# EAGLE design TSOC_GROVEY_WIFI_R0_2 (EAGLE 6.6.0)
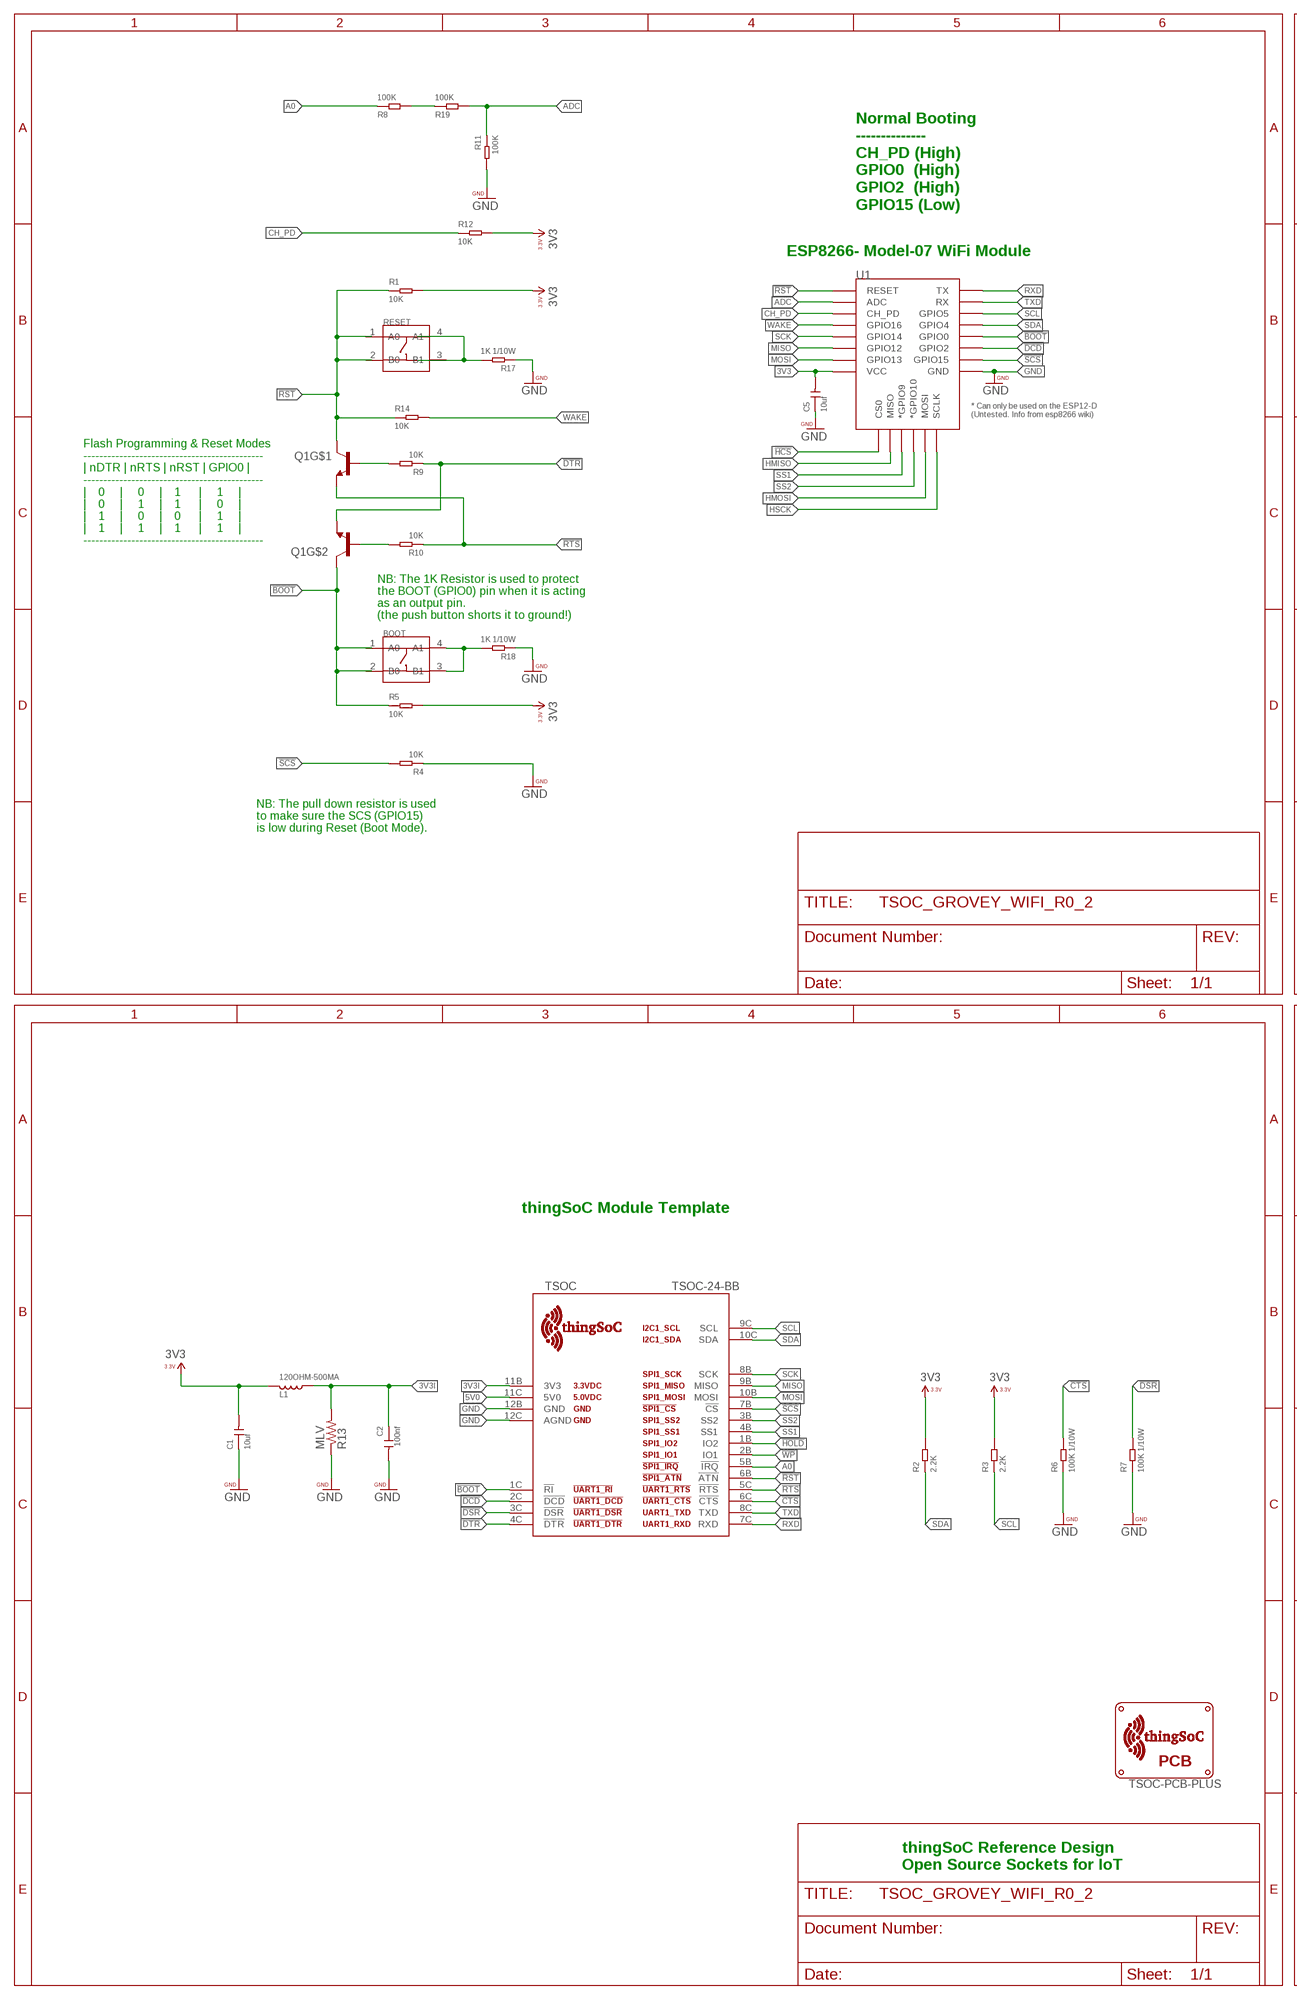
[diagram p0: schematic, sheet 1, part 1 of 2]
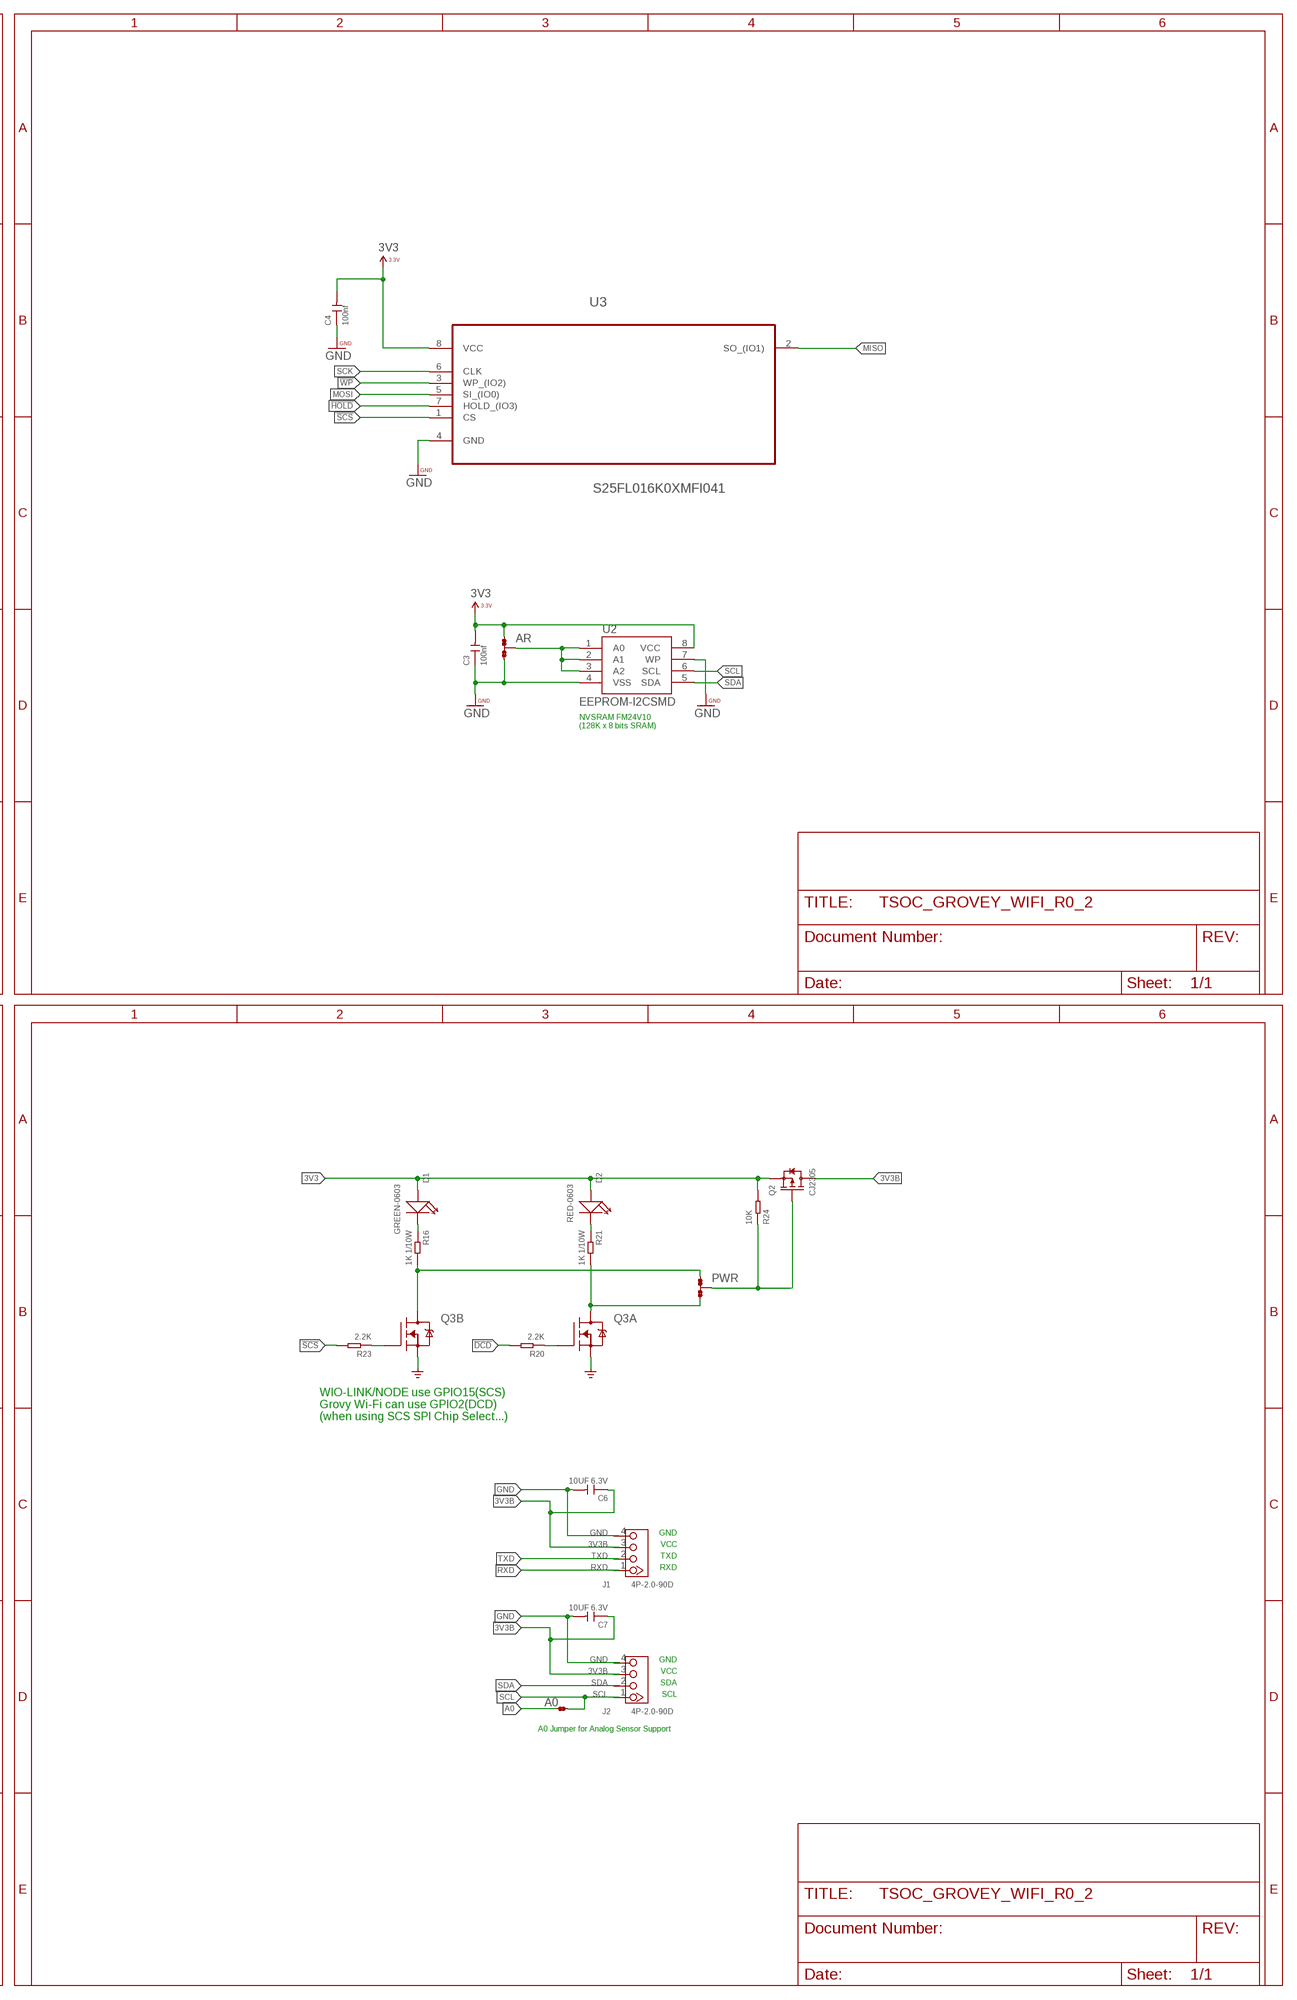
[diagram p1: schematic, sheet 1, part 2 of 2]

## Parts
A0  JMP-2-NO  [JMP-2-NO]
AR  JMP-3-1_2  [JMP-3-1_2]
BOOT  SMD-SWITCH-TACTILE-SPST-NO(4P-D6.0MM)  [SW4-SMD-6.0X6.0X5.0MM]
C1  10uf  CERAMIC-10UF-25V-10%-X5R(1206)  [C1206]
C2  100nf  CERAMIC-100NF-50V-10%-X7R(0603)  [C0603]
C3  100nf  CERAMIC-100NF-50V-10%-X7R(0603)  [C0603]
C4  100nf  CERAMIC-100NF-50V-10%-X7R(0603)  [C0603]
C5  10uf  CERAMIC-10UF-25V-10%-X5R(1206)  [C1206]
C6  10UF 6.3V  CERAMIC-10UF-6.3V-20%-X5R(0603)  [C0603]
C7  10UF 6.3V  CERAMIC-10UF-6.3V-20%-X5R(0603)  [C0603]
D1  GREEN-0603  SMD-LED-CLEAR-GREEN(0603)  [LED-0603]
D2  RED-0603  LED-SMD-RED-DIFFUSED(0603)  [LED-0603]
J1  4P-2.0-90D  GROVE-CONNECTOR-DIP-90D(4P-2.0)  [HW4-2.0-90D]
J2  4P-2.0-90D  GROVE-CONNECTOR-DIP-90D(4P-2.0)  [HW4-2.0-90D]
L1  120OHM-500MA  SMD-FERRITE-CHIP-120-OHM-500MA(0603)  [L0603]
PCB  TSOC-PCB-PLUS  [TSOC-BB-BRD-PLUS-DIM]
PWR  JMP-3-1_2  [JMP-3-1_2]
Q1  MMBT2222A  MMDT3904  [SOT363]
Q2  CJ2305  MOSFET-P'SI2323CDS/SI2305DS<BR>'  [SOT-23]
Q3  FDG1024NZ  [SOT95P280X110-6N]
R1  10K  SMD-RES-10K-1%-1/10W(0603)  [R0603]
R2  2.2K  SMD-RES-2.2K-5%-1/10W(0603)  [R0603]
R3  2.2K  SMD-RES-2.2K-5%-1/10W(0603)  [R0603]
R4  10K  SMD-RES-10K-1%-1/10W(0603)  [R0603]
R5  10K  SMD-RES-10K-1%-1/10W(0603)  [R0603]
R6  100K 1/10W  SMD-RES-100K-5%-1/10W(0603)  [R0603]
R7  100K 1/10W  SMD-RES-100K-5%-1/10W(0603)  [R0603]
R8  100K  SMD-RES-100K-1%-1/10W(0603)  [R0603]
R9  10K  SMD-RES-10K-1%-1/10W(0603)  [R0603]
R10  10K  SMD-RES-10K-1%-1/10W(0603)  [R0603]
R11  100K  SMD-RES-100K-1%-1/10W(0603)  [R0603]
R12  10K  SMD-RES-10K-1%-1/10W(0603)  [R0603]
R13  MLV  RESISTOR0402  [0402-RES]
R14  10K  SMD-RES-10K-1%-1/10W(0603)  [R0603]
R16  1K 1/10W  SMD-RES-1K-5%-1/10W(0603)  [R0603]
R17  1K 1/10W  SMD-RES-1K-5%-1/10W(0603)  [R0603]
R18  1K 1/10W  SMD-RES-1K-5%-1/10W(0603)  [R0603]
R19  100K  SMD-RES-100K-1%-1/10W(0603)  [R0603]
R20  2.2K  SMD-RES-2.2K-5%-1/10W(0603)  [R0603]
R21  1K 1/10W  SMD-RES-1K-5%-1/10W(0603)  [R0603]
R23  2.2K  SMD-RES-2.2K-5%-1/10W(0603)  [R0603]
R24  10K  SMD-RES-10K-1%-1/10W(0603)  [R0603]
RESET  SMD-SWITCH-TACTILE-SPST-NO(4P-D6.0MM)  [SW4-SMD-6.0X6.0X5.0MM]
TSOC  TSOC-24-BB  [TSOC-BB-S24]
U1  ESP12ESMD  [ESP12E-SMD]
U2  EEPROM-I2CSMD  [SO08]
U3  S25FL016K0XMFI041  [SOIC127P600X175-8N]

## Nets
3V3: AR.1 C1.2 C3.2 C4.2 C5.2 D1.+ D2.+ L1.1 Q2.2(S) R1.2 R2.2 R3.2 R5.2 R12.2 R24.2 U1.VCC U2.8(VCC) U3.8(VCC)
3V3B: C6.1 C7.1 J1.3 J2.3 Q2.3(D)
3V3I: C2.1 L1.2 R13.2 TSOC.11B(3V3)
5V0: TSOC.11C(5V0)
!BOOT: BOOT.1(A0) BOOT.2(B0) Q1.6(C) R5.1 TSOC.1C(!RI) U1.GPIO0
!BOOTPD: BOOT.3(B1) BOOT.4(A1) R18.2
!CTS: R6.2 TSOC.6C(!CTS)
!DCD: R20.2 TSOC.2C(!DCD) U1.GPIO2
!DSR: R7.2 TSOC.3C(!DSR)
!DTR: Q1.1(E) R9.1 TSOC.4C(!DTR)
!HCS: U1.CS0
!HOLD: TSOC.1B(IO2) U3.7(HOLD_(IO3))
!RST: Q1.3(C) R1.1 R14.1 RESET.1(A0) RESET.2(B0) TSOC.6B(!ATN) U1.RESET
!RSTPD: R17.2 RESET.3(B1) RESET.4(A1)
!RTS: Q1.4(E) R10.1 TSOC.5C(!RTS)
!SCS: R4.2 R23.2 TSOC.7B(!CS) U1.GPIO15 U3.1(CS)
!WP: TSOC.2B(IO1) U3.3(WP_(IO2))
A0: A0.2 R8.1 TSOC.5B(!IRQ)
ADC: R11.1 R19.2 U1.ADC
ADC2: R8.2 R19.1
CH_PD: R12.1 U1.CH_PD
G0: PWR.3 Q3.6(A:D) R21.2
G15: PWR.1 Q3.3(B:D) R16.2
GND: AR.3 C1.1 C2.2 C3.1 C4.1 C5.1 C6.2 C7.2 J1.4 J2.4 Q3.1(A:S) Q3.4(B:S) R4.1 R6.1 R7.1 R11.2 R13.1 R17.1 R18.1 TSOC.12B(GND) TSOC.12C(AGND) U1.GND U2.4(VSS) U2.7(WP) U3.4(GND) ; supply symbol labelled GND_POWER
GROVEPWR: PWR.2 Q2.1(G) R24.1
HMISO: U1.MISO
HMOSI: U1.MOSI
HSCK: U1.SCLK
LED1: D1.- R16.1
LED2: D2.- R21.1
MISO: TSOC.9B(MISO) U1.GPIO12 U3.2(SO_(IO1))
MOSI: TSOC.10B(MOSI) U1.GPIO13 U3.5(SI_(IO0))
N$3: AR.2 U2.1(A0) U2.2(A1) U2.3(A2)
N$6: Q1.5(B) R9.2
N$10: Q3.2(A:G) R20.1
N$11: Q3.5(B:G) R23.1
N$12: Q1.2(B) R10.2
RXD: J1.1 TSOC.7C(RXD) U1.TXD0(TX)
SCK: TSOC.8B(SCK) U1.GPIO14 U3.6(CLK)
SCL: A0.1 J2.1 R3.1 TSOC.9C(SCL) U1.GPIO5 U2.6(SCL)
SDA: J2.2 R2.1 TSOC.10C(SDA) U1.GPIO4 U2.5(SDA)
SS1: TSOC.4B(SS1) U1.GPIO9(*GPIO9)
SS2: TSOC.3B(SS2) U1.GPIO10(*GPIO10)
TXD: J1.2 TSOC.8C(TXD) U1.RXD0(RX)
WAKE: R14.2 U1.GPIO16

## Notes on the sheet
- Normal Booting
  --------------
  CH_PD (High)
  GPIO0  (High)
  GPIO2  (High) 
  GPIO15 (Low)
- ESP8266- Model-07 WiFi Module
- Flash Programming & Reset Modes
  ---------------------------------------------
  | nDTR | nRTS | nRST | GPIO0 |
  ---------------------------------------------
  |    0     |     0     |    1      |     1     |
  |    0     |     1     |    1      |     0     |
  |    1     |     0     |    0      |     1     |
  |    1     |     1     |    1      |     1     |
  ---------------------------------------------
- NB: The 1K Resistor is used to protect
  the BOOT (GPIO0) pin when it is acting
  as an output pin.
  (the push button shorts it to ground!)
- NVSRAM FM24V10
  (128K x 8 bits SRAM)
- NB: The pull down resistor is used 
  to make sure the SCS (GPIO15)
  is low during Reset (Boot Mode).
- thingSoC Module Template
- WIO-LINK/NODE use GPIO15(SCS) 
  Grovy Wi-Fi can use GPIO2(DCD) 
  (when using SCS SPI Chip Select...)
- GND
- VCC
- TXD
- RXD
- GND
- VCC
- SDA
- SCL
- A0 Jumper for Analog Sensor Support
- thingSoC Reference Design
  Open Source Sockets for IoT

## Library data of the parts
A0 = PatternAgents-ProtoPads:JMP-2-NO: Two Terminal Jumper - Normally Open Positions 1 and 2 are normally NOT connected. PatternAgents ProtoPads Library Schematic and PCB layout libraries for design patterns by PatternAgents. For the CADSoft Eagle CAD program : http://www.cadsoftusa.com/download-eagle/ Source LBR : http://www.patternagents.com Github : https://github.com/PatternAgents License : http://creativecommons.org/licenses/by-sa/4.0/ (Creative Commons 4.0) THIS SOFTWARE IS PROVIDED BY THE CONTRIBUTORS "AS IS" AND WITHOUT ANY EXPRESS OR IMPLIED WARRANTIES, INCLUDING, BUT NOT LIMITED TO, THE IMPLIED WARRANTIES OF MERCHANTABILITY AND FITNESS FOR A PARTICULAR PURPOSE ARE DISCLAIMED. IN NO EVENT SHALL THE COPYRIGHT OWNER OR CONTRIBUTORS BE LIABLE FOR ANY DIRECT, INDIRECT, INCIDENTAL, SPECIAL, EXEMPLARY, OR CONSEQUENTIAL DAMAGES (INCLUDING, BUT NOT LIMITED TO, PROCUREMENT OF SUBSTITUTE GOODS OR SERVICES; LOSS OF USE, DATA, OR PROFITS; OR BUSINESS INTERRUPTION) HOWEVER CAUSED AND ON ANY THEORY OF LIABILITY, WHETHER IN CONTRACT, STRICT LIABILITY, OR TORT (INCLUDING NEGLIGENCE OR OTHERWISE) ARISING IN ANY WAY OUT OF THE USE OF THIS SOFTWARE, EVEN IF ADVISED OF THE POSSIBILITY OF SUCH DAMAGE.; BOM: EXCLUDE
AR PWR = PatternAgents-ProtoPads:JMP-3-1_2: Three Terminal Jumper - 1 & 2 Connected Positions 1and 2 are normally connected. PatternAgents ProtoPads Library Schematic and PCB layout libraries for design patterns by PatternAgents. For the CADSoft Eagle CAD program : http://www.cadsoftusa.com/download-eagle/ Source LBR : http://www.patternagents.com Github : https://github.com/PatternAgents License : http://creativecommons.org/licenses/by-sa/4.0/ (Creative Commons 4.0) THIS SOFTWARE IS PROVIDED BY THE CONTRIBUTORS "AS IS" AND WITHOUT ANY EXPRESS OR IMPLIED WARRANTIES, INCLUDING, BUT NOT LIMITED TO, THE IMPLIED WARRANTIES OF MERCHANTABILITY AND FITNESS FOR A PARTICULAR PURPOSE ARE DISCLAIMED. IN NO EVENT SHALL THE COPYRIGHT OWNER OR CONTRIBUTORS BE LIABLE FOR ANY DIRECT, INDIRECT, INCIDENTAL, SPECIAL, EXEMPLARY, OR CONSEQUENTIAL DAMAGES (INCLUDING, BUT NOT LIMITED TO, PROCUREMENT OF SUBSTITUTE GOODS OR SERVICES; LOSS OF USE, DATA, OR PROFITS; OR BUSINESS INTERRUPTION) HOWEVER CAUSED AND ON ANY THEORY OF LIABILITY, WHETHER IN CONTRACT, STRICT LIABILITY, OR TORT (INCLUDING NEGLIGENCE OR OTHERWISE) ARISING IN ANY WAY OUT OF THE USE OF THIS SOFTWARE, EVEN IF ADVISED OF THE POSSIBILITY OF SUCH DAMAGE.; BOM: EXCLUDE
BOOT RESET = Seeed-Switch-2016:SMD-SWITCH-TACTILE-SPST-NO(4P-D6.0MM): 311020004; MPN: DTSM-62K-S-V-T/R(SN431)
C1 C5 = Seeed-Capacitor-2016:CERAMIC-10UF-25V-10%-X5R(1206): 302010181; MPN: CC1206KKX5R8BB106
C2-C4 = Seeed-Capacitor-2016:CERAMIC-100NF-50V-10%-X7R(0603): 302010138; MPN: CC0603KRX7R9BB104
C6 C7 = Seeed-Capacitor-2016:CERAMIC-10UF-6.3V-20%-X5R(0603): 302010286; MPN: CC0603MRX5R5BB106
D1 = Seeed-LED-2016:SMD-LED-CLEAR-GREEN(0603): 304090043; MPN: 19-217-G7C-AN1P2-3T
D2 = Seeed-LED-2016:LED-SMD-RED-DIFFUSED(0603): 304090042; MPN: 19-217-R6C-AL1M2VY-3T
J1 J2 = Seeed-Connector -2016:GROVE-CONNECTOR-DIP-90D(4P-2.0): 320110034
L1 = Seeed-Inductor-2016:SMD-FERRITE-CHIP-120-OHM-500MA(0603): 303030001; MPN: BLM18AG121SN1D
PCB = thingSoC:TSOC-PCB: thingSoC PCB Outlines Boards Outlines for Standard Sizes (in the DImension Layer) (Registration marks in the tDocu layer - make sure to turn on tDocu/bDocu) Source LBR : http://www.thingsoc.com Github : https://github.com/thingsoc License : http://creativecommons.org/licenses/by-sa/4.0/ (Creative Commons 4.0) THIS SOFTWARE IS PROVIDED BY THE CONTRIBUTORS "AS IS" AND WITHOUT ANY EXPRESS OR IMPLIED WARRANTIES, INCLUDING, BUT NOT LIMITED TO, THE IMPLIED WARRANTIES OF MERCHANTABILITY AND FITNESS FOR A PARTICULAR PURPOSE ARE DISCLAIMED. IN NO EVENT SHALL THE COPYRIGHT OWNER OR CONTRIBUTORS BE LIABLE FOR ANY DIRECT, INDIRECT, INCIDENTAL, SPECIAL, EXEMPLARY, OR CONSEQUENTIAL DAMAGES (INCLUDING, BUT NOT LIMITED TO, PROCUREMENT OF SUBSTITUTE GOODS OR SERVICES; LOSS OF USE, DATA, OR PROFITS; OR BUSINESS INTERRUPTION) HOWEVER CAUSED AND ON ANY THEORY OF LIABILITY, WHETHER IN CONTRACT, STRICT LIABILITY, OR TORT (INCLUDING NEGLIGENCE OR OTHERWISE) ARISING IN ANY WAY OUT OF THE USE OF THIS SOFTWARE, EVEN IF ADVISED OF THE POSSIBILITY OF SUCH DAMAGE.
Q1 = SparkFun-DiscreteSemi:MMDT3904: Dual NPN transistor
Q2 = Discrete-new:MOSFET-P
Q3 = PatternAgents-Fairchild:FDG1024NZ: FDG1024NZ Dual N-Channel PowerTrench® MOSFET 20 V, 1.2 A, 175 mΩ
R1 R4 R5 R9 R10 R12 R14 R24 = Seeed-Resistor-2016:SMD-RES-10K-1%-1/10W(0603): 301010299; MPN: RC0603FR-0710KL
R2 R3 R20 R23 = Seeed-Resistor-2016:SMD-RES-2.2K-5%-1/10W(0603): 301010124; MPN: RC0603JR-072K2L
R6 R7 = Seeed-Resistor-2016:SMD-RES-100K-5%-1/10W(0603): 301010089; MPN: RC0603JR-07100KL
R8 R11 R19 = Seeed-Resistor-2016:SMD-RES-100K-1%-1/10W(0603): 301010196; MPN: RC0603FR-07100KL
R13 = PatternAgents-ProtoPads:RESISTOR: Resistor Basic schematic elements and footprints for 0603, 1206, and PTH resistors.
R16-R18 R21 = Seeed-Resistor-2016:SMD-RES-1K-5%-1/10W(0603): 301010291; MPN: RC0603JR-071KL
TSOC = thingSoC:TSOC-24: thingSoC Twenty-Four(24) Pin Socket Source LBR : http://www.thingsoc.com Github : https://github.com/thingsoc License : http://creativecommons.org/licenses/by-sa/4.0/ (Creative Commons 4.0) THIS SOFTWARE IS PROVIDED BY THE CONTRIBUTORS "AS IS" AND WITHOUT ANY EXPRESS OR IMPLIED WARRANTIES, INCLUDING, BUT NOT LIMITED TO, THE IMPLIED WARRANTIES OF MERCHANTABILITY AND FITNESS FOR A PARTICULAR PURPOSE ARE DISCLAIMED. IN NO EVENT SHALL THE COPYRIGHT OWNER OR CONTRIBUTORS BE LIABLE FOR ANY DIRECT, INDIRECT, INCIDENTAL, SPECIAL, EXEMPLARY, OR CONSEQUENTIAL DAMAGES (INCLUDING, BUT NOT LIMITED TO, PROCUREMENT OF SUBSTITUTE GOODS OR SERVICES; LOSS OF USE, DATA, OR PROFITS; OR BUSINESS INTERRUPTION) HOWEVER CAUSED AND ON ANY THEORY OF LIABILITY, WHETHER IN CONTRACT, STRICT LIABILITY, OR TORT (INCLUDING NEGLIGENCE OR OTHERWISE) ARISING IN ANY WAY OUT OF THE USE OF THIS SOFTWARE, EVEN IF ADVISED OF THE POSSIBILITY OF SUCH DAMAGE.
U1 = PatternAgents_RFmodules:ESP12E: ESP12E Module
U2 = SparkFun-DigitalIC:EEPROM-I2C: I2C EEPROM chips, 24LC256 (and others)
U3 = Spansion_By_element14_Batch_1:S25FL016K0XMFI041: 16-Mbit CMOS 3.0 Volt Flash Memory; MPN: S25FL016K0XMFI041; OC_FARNELL: 1861629; OC_NEWARK: 27T2972; PACKAGE: SOIC-8; SUPPLIER: SPANSION

## Board
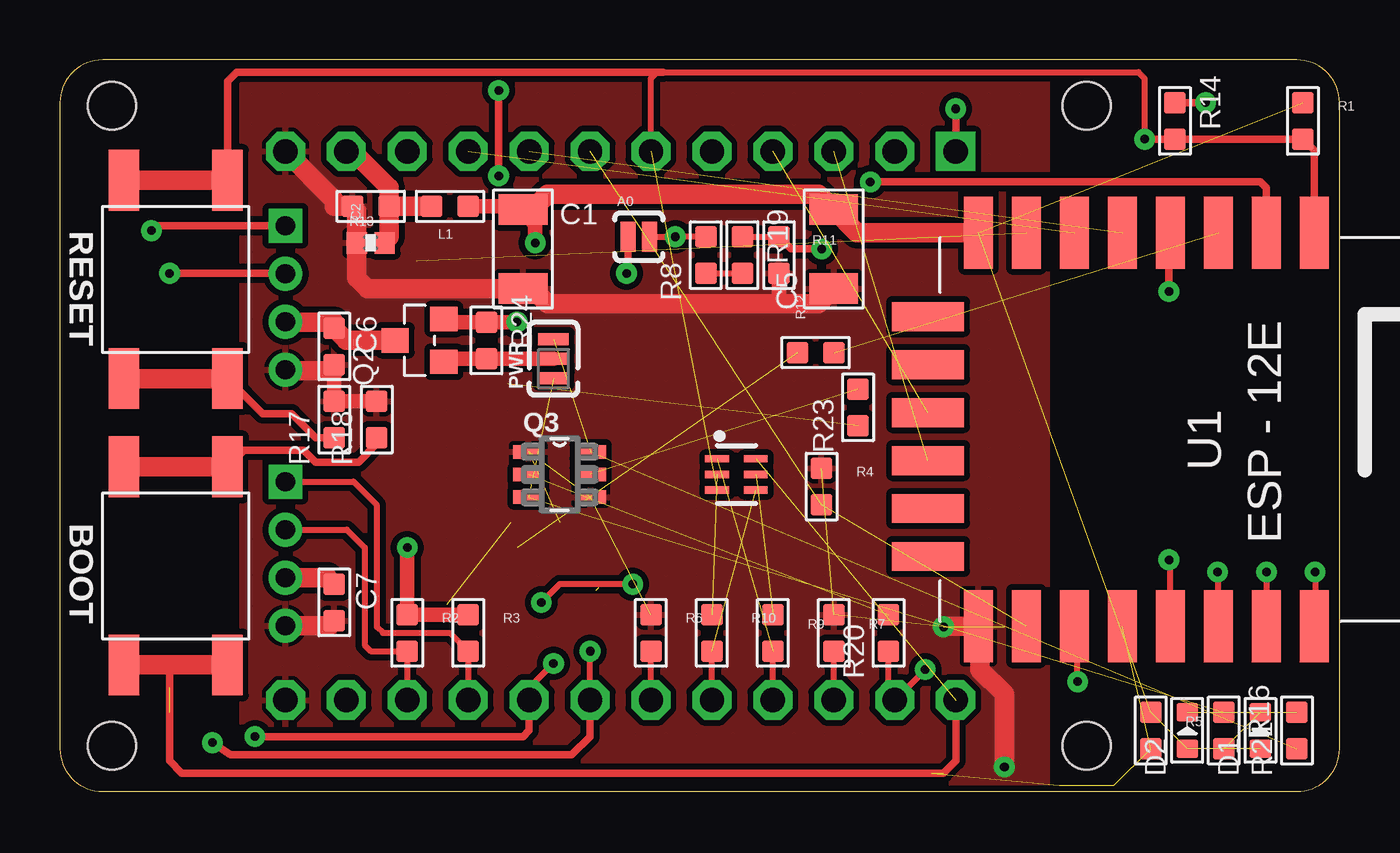
[diagram p2: board, top side]
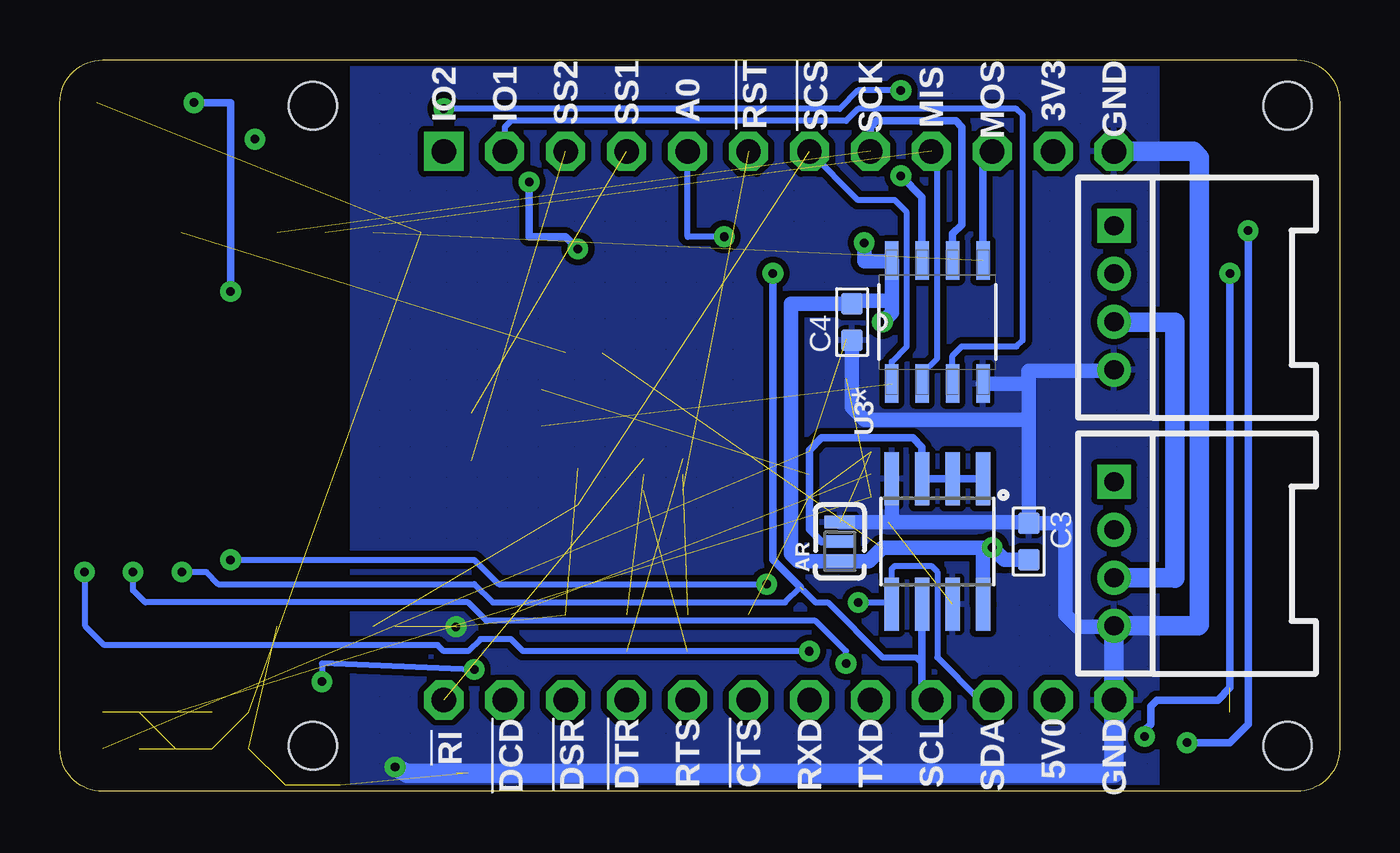
[diagram p3: board, bottom side, seen from below]

Size 53.34 x 30.48 mm. Coordinates in mm from the lower left corner, seen from the top.
Copper layers (1*16): Top 0.035mm / dielectric 1.5mm / Bottom 0.035mm
Design rules "PatternAgents_7mil": minimum track width 7mil, minimum drill 14mil, track to track 7mil, track to pad 7mil, pad to pad 7mil, via to via 7mil, smd to smd 7mil, copper to edge 7mil, drill to drill 7mil, minimum pad ring 12mil, minimum via ring 10mil, stop-mask expansion 4mil, vias tented up to drill 25mil, thermal gap 7mil

### Footprints (pad centres in the part's own frame; a part is rotated, then mirrored left to right if it is on the bottom)
JMP-2-NO = smd 0.635 x 1.27: 1 -0.45,0; 2 0.45,0
JMP-3-1_2 = smd 0.508 x 1.27: 1 -0.813,0; 2 0,0; 3 0.813,0
SW4-SMD-6.0X6.0X5.0MM = smd 2.54 x 1.27: 1 -4.129,2.159; 2 -4.129,-2.159; 3 4.129,-2.159; 4 4.129,2.159
C1206 = smd 1.27 x 2.032: 1 -1.651,0; 2 1.651,0
C0603 = smd 0.889 x 0.889: 1 0,0.762; 2 0,-0.762
LED-0603 = smd 0.762 x 0.889: + -0.762,0; - 0.762,0
HW4-2.0-90D = drill 0.8 pad 1.27 square: 1 -3,0 | drill 0.8 pad 1.27: 2 -1,0; 3 1,0; 4 3,0
L0603 = smd 0.889 x 0.889: 1 -0.762,0; 2 0.762,0
TSOC-BB-BRD-PLUS-DIM = hole 2: -13.335,-23.749; 13.335,-23.749; -13.335,16.891; 13.335,16.891
SOT363 = smd 0.3 x 0.99: 1 -0.65,-0.8; 2 0,-0.8; 3 0.65,-0.8; 4 0.65,0.81; 5 0,0.81; 6 -0.65,0.81
SOT-23 = smd 1.016 x 1.143: 1 -0.889,-1.016; 2 0.889,-1.016; 3 0,1.016
SOT95P280X110-6N = smd 1.27 x 0.559: 1 -1.295,0.94; 2 -1.295,0; 3 -1.295,-0.94; 4 1.295,-0.94; 5 1.295,0; 6 1.295,0.94
R0603 = smd 0.889 x 0.889: 1 0,0.762; 2 0,-0.762
0402-RES = smd 0.85 x 0.9: 1 -0.58,0; 2 0.58,0
TSOC-BB-S24 = drill 1.016 square: 1B -11.43,11.43 | drill 1.016 octagon: 1C 11.43,11.43; 2B -11.43,8.89; 2C 11.43,8.89; 3B -11.43,6.35; 3C 11.43,6.35; 4B -11.43,3.81; 4C 11.43,3.81; 5B -11.43,1.27; 5C 11.43,1.27; 6B -11.43,-1.27; 6C 11.43,-1.27; 7B -11.43,-3.81; 7C 11.43,-3.81; 8B -11.43,-6.35; 8C 11.43,-6.35; 9B -11.43,-8.89; 9C 11.43,-8.89; 10B -11.43,-11.43; 10C 11.43,-11.43; 11B -11.43,-13.97; 11C 11.43,-13.97; 12B -11.43,-16.51; 12C 11.43,-16.51
ESP12E-SMD = smd 3 x 1.2: ADC -8.3,3.8; CH_PD -8.3,1.8; GND 8.1,-8.2; GPIO0 8.1,-2.2; GPIO2 8.1,-4.2; GPIO4 8.1,-0.2; GPIO5 8.1,1.8; GPIO12 -8.3,-4.2; GPIO13 -8.3,-6.2; GPIO14 -8.3,-2.2; GPIO15 8.1,-6.2; GPIO16 -8.3,-0.2; RESET -8.3,5.8; RXD0 8.1,3.8; TXD0 8.1,5.8; VCC -8.3,-8.2 | smd 1.2 x 3: CS0 -4.8,-10.3; GPIO9 -0.8,-10.3; GPIO10 1.2,-10.3; MISO -2.8,-10.3; MOSI 3.2,-10.3; SCLK 5.2,-10.3
SO08 = smd 0.61 x 2.21: 1 -1.905,-2.616; 2 -0.635,-2.616; 3 0.635,-2.616; 4 1.905,-2.616; 5 1.905,2.616; 6 0.635,2.616; 7 -0.635,2.616; 8 -1.905,2.616
SOIC127P600X175-8N = smd 1.6 x 0.559: 1 -2.565,1.905; 2 -2.565,0.635; 3 -2.565,-0.635; 4 -2.565,-1.905; 5 2.565,-1.905; 6 2.565,-0.635; 7 2.565,0.635; 8 2.565,1.905

### Placement (x,y rotation side)
A0  24.13,23.11 0 top
AR  20.83,10.41 90 bottom
BOOT  4.83,9.4 90 top
C1  19.3,22.61 90 top
C2  12.95,24.38 270 top
C3  12.95,10.41 0 bottom
C4  20.32,19.56 180 bottom
C5  32.26,22.61 90 top
C6  11.43,18.54 0 top
C7  11.43,7.87 0 top
D1  50.04,2.54 90 top
D2  46.99,2.54 90 top
J1  9.4,20.57 270 bottom
J2  9.4,9.91 270 bottom
L1  16.26,24.38 180 top
PCB  25.91,15.24 270 top
PWR  20.57,18.03 90 top
Q1  28.19,13.21 270 top
Q2  14.99,18.8 90 top
Q3  20.83,13.21 0 top
R1  51.82,27.94 180 top
R2  14.48,6.6 180 top
R3  17.02,6.6 180 top
R4  31.75,12.7 0 top
R5  45.47,2.54 180 top
R6  24.64,6.6 0 top
R7  32.26,6.6 0 top
R8  26.92,22.35 0 top
R9  29.72,6.6 180 top
R10  27.18,6.6 180 top
R11  29.97,22.35 0 top
R12  31.5,18.29 270 top
R13  12.95,22.86 0 top
R14  46.48,27.94 180 top
R16  48.51,2.54 180 top
R17  11.43,15.49 0 top
R18  13.21,15.49 0 top
R19  28.45,22.35 180 top
R20  34.54,6.6 0 top
R21  51.56,2.54 0 top
R23  33.27,16 0 top
R24  17.78,18.8 180 top
RESET  4.83,21.34 270 top
TSOC  25.91,15.24 270 top
U1  46.48,14.99 270 top
U2  16.76,10.41 180 bottom
U3  16.76,19.56 90 bottom

### Tracks (layer width: path | path; a pad name or v marks a point on that pad's centre or on a via)
3V3  (via drill 0.36)  (5 unrouted)
  Top 0.61: L1.1 19.18,24.38 C1.2 19.81,23.62 v19.81,22.86 | v19.05,19.56 R24.2 16.13,19.56 Q2.2 | v14.48,10.16 R2.2 R3.2
  Top 0.813: C1.2 19.68,24.26 20.32,24.89 31.62,24.89 C5.2 33.23,23.29 U1.VCC
  Bottom 0.61: 18.67,20.45 U3.8 18.69,22.1 19.81,22.1 v19.81,22.86 | 18.67,20.45 20.19,20.45 C4.2 22.86,20.32 22.86,9.91 22.55,9.6 AR.1 19.61,9.6 19.05,10.16 14.99,10.16 | 18.67,20.45 18.67,19.94 v19.05,19.56 | C3.2 13.97,9.65 v14.48,10.16 14.99,10.16 | U2.8 14.86,10.03 14.99,10.16
3V3B
  Top 0.813: J1.3 9.41,19.56 11.43,19.56 C6.1 11.94,18.8 Q2.3 | J2.3 11.16,8.91 C7.1
  Bottom 0.813: J2.3 6.87,8.91 6.86,8.89 6.86,19.56 9.38,19.56 J1.3
3V3I
  Top 0.813: TSOC.11B 12.19,26.67 13.72,25.15 C2.1 | C2.1 L1.2 | R13.2 13.53,22.93 13.72,23.11 C2.1
!BOOT  (6 unrouted)
  Top 0.305: BOOT.2 4.64,5.27 4.57,5.33 4.57,1.27 5.08,0.76 36.83,0.76 37.34,1.27 TSOC.1C
  Top 0.813: BOOT.2 BOOT.1
!BOOTPD
  Top 0.305: R18.2 13.21,14.48 12.45,13.72 10.67,13.72 10.16,14.22 7.68,14.22 BOOT.3
  Top 0.813: BOOT.3 BOOT.4
!CTS
  Top 0.254: TSOC.6C R6.2
!DCD  (via drill 0.36)
  Top 0.254: v36.07,5.08 TSOC.2C 34.54,4.06 R20.2 | v42.42,4.57 42.42,6.75 U1.GPIO2
  Bottom 0.254: v36.07,5.08 42.42,5.33 v42.42,4.57
!DSR
  Top 0.254: TSOC.3C R7.2
!DTR  (1 unrouted)
  Top 0.254: TSOC.4C R9.1
!HOLD  (via drill 0.36)
  Top 0.305: v18.29,25.65 v18.29,29.21 | v37.34,28.45 TSOC.1B
  Bottom 0.254: v18.29,29.21 20.07,29.21 20.83,28.45 v37.34,28.45
  Bottom 0.305: U3.7 17.4,24.77 v18.29,25.65
!RST  (via drill 0.36)  (1 unrouted)
  Top 0.254: TSOC.6B 24.64,29.72 24.89,29.97 25.15,29.97 44.96,29.97 45.21,29.72 v45.21,27.18
  Top 0.305: U1.RESET 52.28,26.71 R1.1 R14.1 v45.21,27.18 | RESET.1 6.99,29.59 7.37,29.97 25.15,29.97
  Top 0.813: RESET.1 RESET.2
!RSTPD
  Top 0.305: R17.2 10.67,14.73 9.65,15.75 8.44,15.75 RESET.4
  Top 0.813: RESET.4 RESET.3
!RTS  (1 unrouted)
  Top 0.254: TSOC.5C R10.1
!SCS  (3 unrouted)
  Bottom 0.254: U3.1 18.67,17.91 18.03,18.54 18.03,24.13 18.54,24.64 20.07,24.64 TSOC.7B
!WP
  Bottom 0.254: U3.3 16.13,18.16 15.75,18.54 13.46,18.54 13.21,18.8 13.21,28.19 13.46,28.45 20.07,28.45 20.57,27.94 34.54,27.94 34.8,27.69 TSOC.2B
A0  (via drill 0.36)
  Top 0.254: A0.2 v25.65,23.11 R8.1
  Bottom 0.254: v25.65,23.11 27.18,23.11 TSOC.5B
ADC  (via drill 0.36)
  Top 0.254: R19.2 R11.1
  Top 0.305: U1.ADC 50.28,25.16 50.04,25.4 v33.78,25.4 | v31.75,22.61 30.48,22.61 R11.1
  Bottom 0.305: v33.78,25.4 33.78,23.11 32.26,23.11 v31.75,22.61
ADC2
  Top 0.254: R8.2 R19.1
CH_PD  (1 unrouted)
G0  (2 unrouted)
G15  (2 unrouted)
GND  (via drill 0.36)  (7 unrouted)
  Top 0.61: R11.2 29.97,20.32 | C6.2 R17.1 R18.1
  Top 0.813: C6.2 11.43,17.53 9.45,17.53 J1.4 | J2.4 11.22,6.91 C7.2 | v36.83,6.86 36.86,6.89 U1.GND 38.35,6.81 38.35,5.08 39.37,4.06 v39.37,1.02 | TSOC.12B 11.43,24.64 11.43,24.38 C2.2 12.37,24.2 R13.1 12.37,21.41 12.83,20.95 C1.1 19.68,20.95 20.32,20.32 29.97,20.32 31.62,20.32 C5.1
  Bottom 0.61: AR.3 18.8,11.23 | 18.8,11.23 13.01,11.23 C3.1 | U2.4 18.67,11.35 18.8,11.23 | C3.1 11.43,11.18 11.43,7.37 10.92,6.86 9.45,6.86 J2.4 | 12.95,17.53 12.95,17.02 | 12.95,17.02 12.95,15.49 | 12.95,15.49 C3.1 | U3.4 12.98,16.99 | 12.98,16.99 12.95,17.02 | 12.98,16.99 12.98,17.5 12.95,17.53 | 12.95,17.53 9.45,17.53 J1.4 | C4.1 20.32,16 19.81,15.49 12.95,15.49
  Bottom 0.813: v39.37,1.02 38.86,0.76 9.4,0.76 TSOC.12C J2.4 5.89,6.91 5.84,6.95 5.84,26.42 6.1,26.67 TSOC.12B
  pour Bottom (isolate 0.254, hatched): 7.62,0 7.62,30.48 41.15,30.48 41.15,0
  pour Top (isolate 0.254, hatched): 7.62,0 7.62,30.48 41.15,30.48 41.15,0
GROVEPWR
  Top 0.61: PWR.2 R24.1 16.13,18.03 Q2.1
LED1  (1 unrouted)
LED2  (1 unrouted)
MISO  (1 unrouted)
  Bottom 0.254: U3.2 17.4,17.4 16.76,18.03 16.76,26.42 TSOC.9B
MOSI  (1 unrouted)
  Bottom 0.305: U3.5 14.86,26.29 TSOC.10B
N$3
  Bottom 0.305: U2.1 U2.2 U2.3 17.4,14.35 17.78,14.73 21.59,14.73 22.1,14.22 22.1,10.92 21.59,10.41 AR.2
N$6  (1 unrouted)
N$10  (1 unrouted)
N$11  (1 unrouted)
N$12  (1 unrouted)
RXD  (via drill 0.36)
  Top 0.254: TSOC.7C v22.1,5.84 | v52.32,9.14 52.32,6.93 U1.TXD0
  Top 0.305: J1.1 4.02,23.57 v3.81,23.37 | TSOC.7C 22.1,2.29 21.34,1.52 7.11,1.52 v6.35,2.03
  Bottom 0.254: v22.1,5.84 34.04,5.84 34.54,6.35 35.81,6.35 36.32,5.84 37.34,5.84 37.59,6.1 51.49,6.1 U1.TXD0 52.28,9.1 v52.32,9.14
  Bottom 0.305: v3.81,23.37 3.81,2.79 4.57,2.03 v6.35,2.03
SCK  (1 unrouted)
  Bottom 0.305: U3.6 16.13,23.24 15.75,23.62 15.75,27.69 16,27.94 19.3,27.94 19.56,27.69 TSOC.8B
SCL  (via drill 0.36)  (1 unrouted)
  Top 0.254: TSOC.9C R3.1 16.26,6.6 13.46,6.6 13.21,6.86 13.21,11.94 12.24,12.91 J2.1 | U1.GPIO5 48.28,9.12 v48.26,9.14
  Top 0.305: A0.1 23.68,22.04 v23.62,21.59
  Bottom 0.254: v48.26,9.14 47.24,9.14 46.74,8.64 36.07,8.64 35.31,7.87 23.11,7.87 22.48,8.51 | 22.35,8.38 21.84,7.87 21.34,7.87 19.05,5.59 17.65,5.59 17.4,5.33
  Bottom 0.305: U2.6 17.4,5.33 17.4,4.19 TSOC.9C | v23.62,21.59 23.62,9.65 22.48,8.51
SDA  (via drill 0.36)
  Top 0.254: J2.2 11.95,10.91 12.7,10.16 12.7,6.1 12.95,5.84 R2.1 TSOC.10C | U1.GPIO4 46.28,9.6 v46.23,9.65 | v23.88,8.64 20.83,8.64 v20.07,7.87
  Bottom 0.254: TSOC.10C 14.99,3.81 16.76,5.59 16.76,9.14 17.02,9.4 18.54,9.4 18.67,9.27 U2.5 18.75,7.87 v20.07,7.87 | v46.23,9.65 36.07,9.65 35.05,8.64 v23.88,8.64
SS1  (1 unrouted)
SS2  (1 unrouted)
TXD  (via drill 0.36)  (1 unrouted)
  Top 0.254: TSOC.8C 19.56,4.32 v20.57,5.33 | v50.29,9.14 50.29,6.9 U1.RXD0
  Top 0.305: v4.57,21.59 9.38,21.59 J1.2 | TSOC.8C 19.56,2.54 19.3,2.29 v8.13,2.29
  Bottom 0.254: v20.57,5.33 20.57,5.84 21.84,7.11 35.56,7.11 36.32,7.87 49.78,7.87 50.29,8.38 v50.29,9.14
  Bottom 0.305: v4.57,21.59 4.57,4.32 5.08,3.81 7.62,3.81 7.87,3.56 7.87,2.79 8.13,2.54 v8.13,2.29
WAKE  (via drill 0.36)
  Top 0.305: R14.2 v47.75,28.7 | v46.23,20.83 46.23,23.23 U1.GPIO16
  Bottom 0.305: v47.75,28.7 46.23,28.7 v46.23,20.83

### Text on the board
bPlace: GND | 3V3 | MOS | MIS | SCK | !SCS | !RST | A0 | SS1 | SS2 | IO1 | IO2 | GND | 5V0 | SDA | SCL | TXD | RXD | !CTS | RTS | !DTR | !DSR | !DCD | !RI